# Altium project NyaBall.PrjPcb
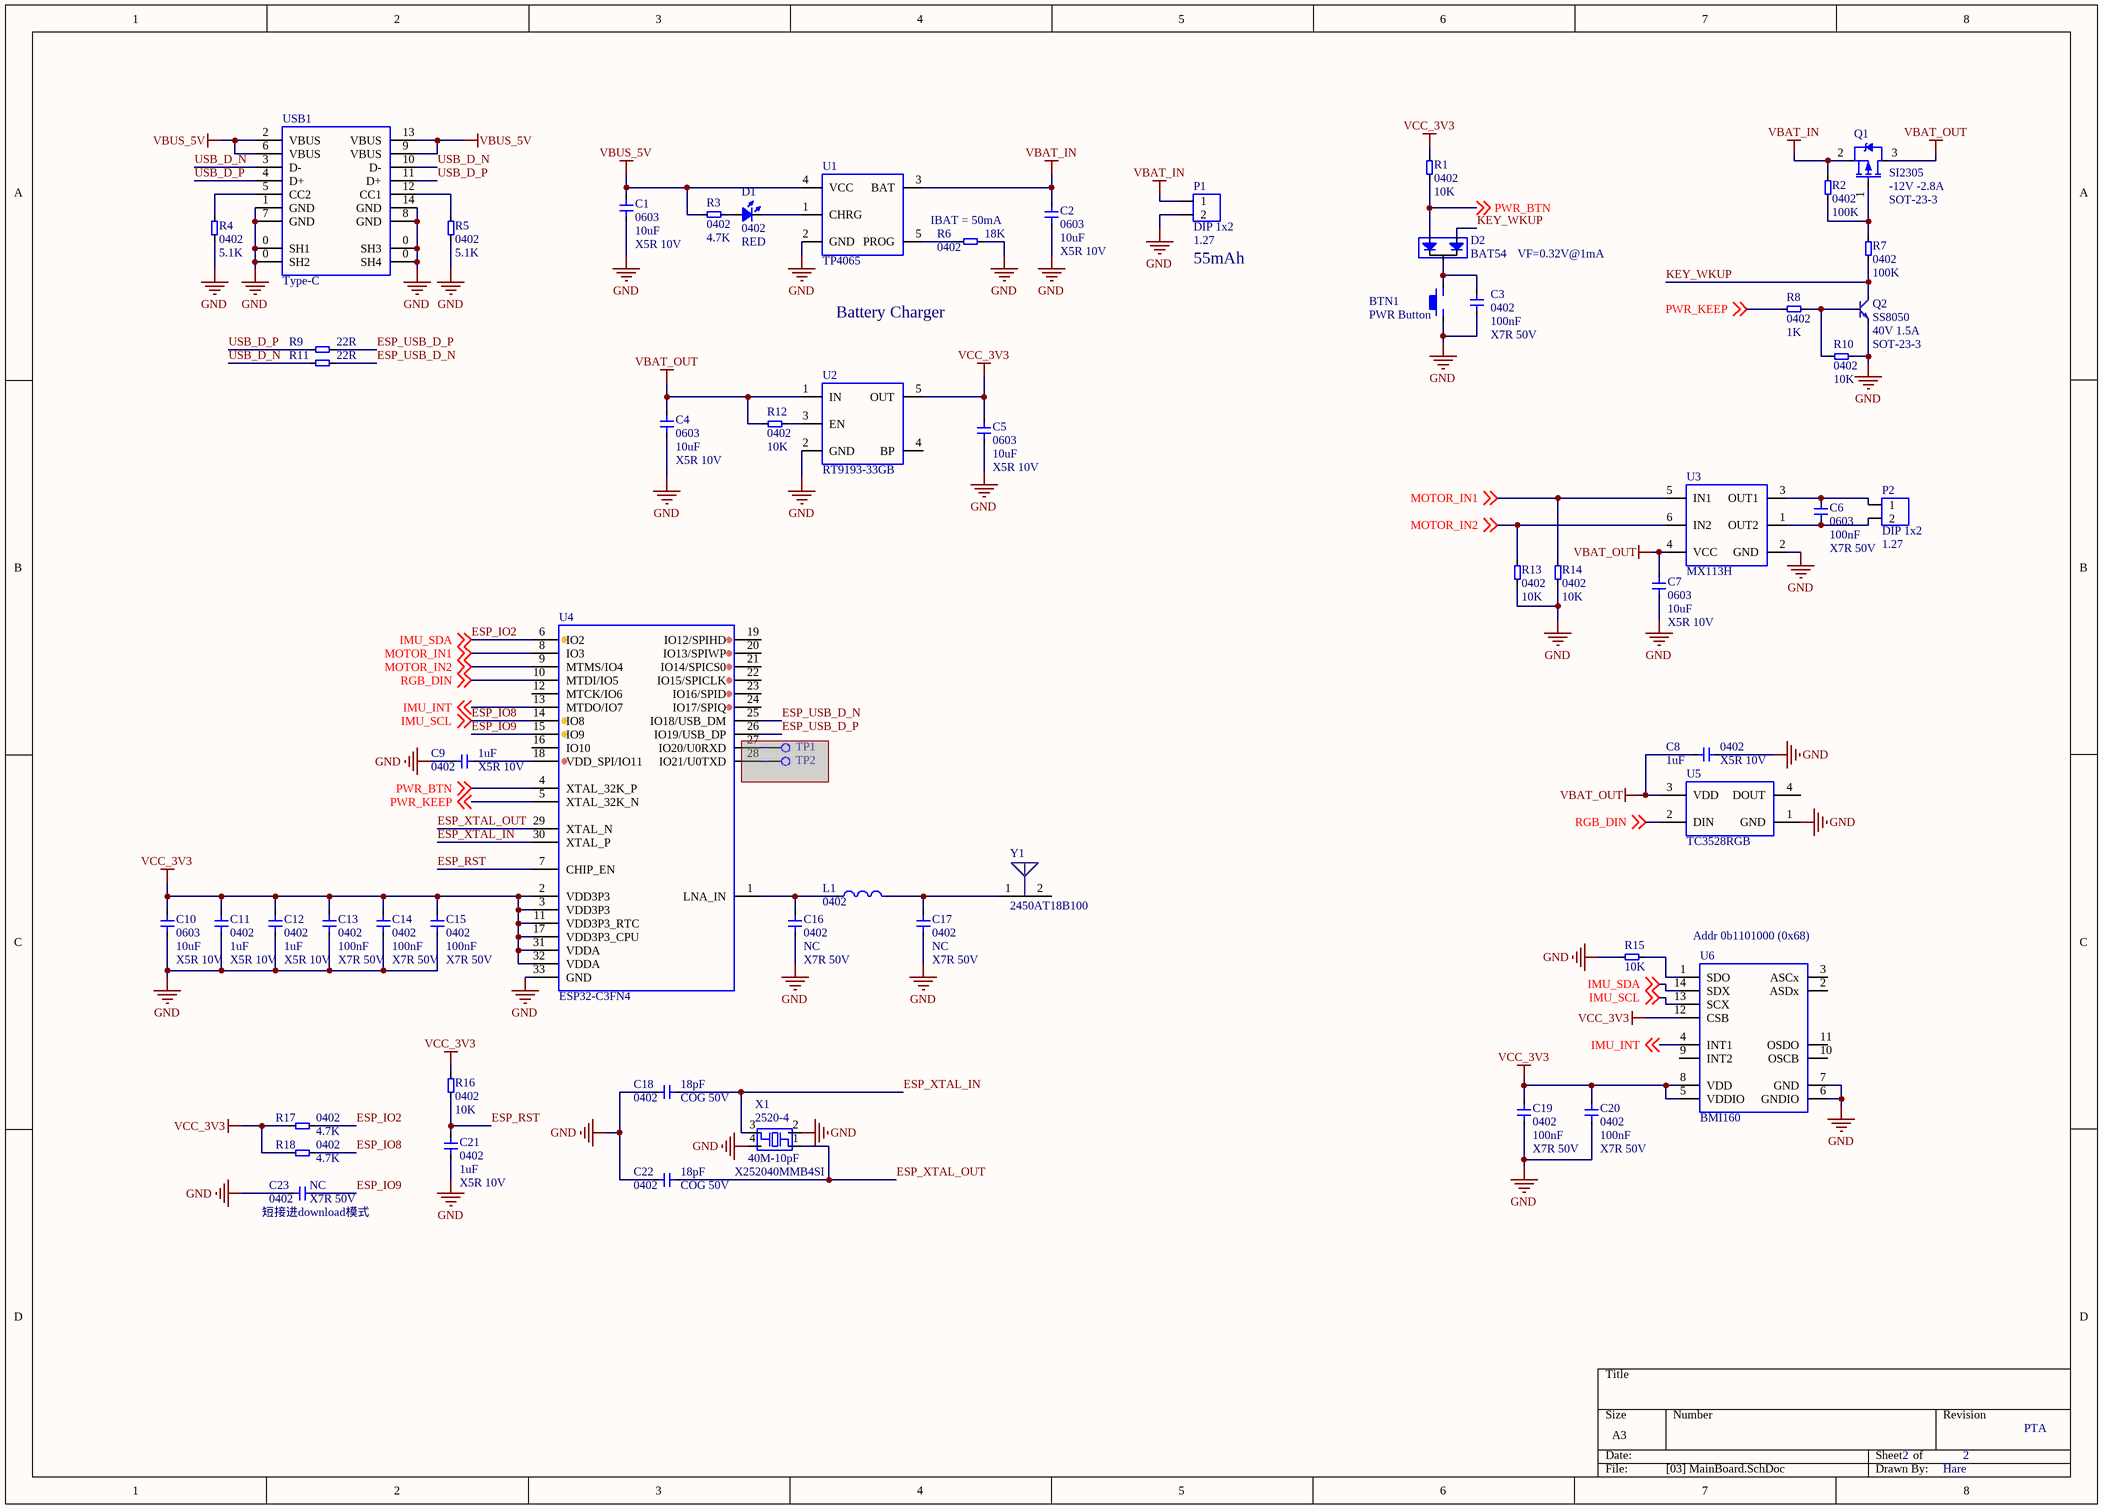
[diagram p0: [03] MainBoard.SchDoc]
1 sheet, 60 parts. Net scope: global (net labels, ports and power ports of the same name join across sheets).
Board file: NyaBall.PcbDoc

## Sheet [03] MainBoard.SchDoc
size A3

### Parts
BTN1  PWR Button  [BTN_2S]
C1  Footprint: 0603  Specification: X5R 10V  [CAP_0603]  (hidden comment: 10uF)
C2  Footprint: 0603  Specification: X5R 10V  [CAP_0603]  (hidden comment: 10uF)
C3  Footprint: 0402  Specification: X7R 50V  [CAP_0402]  (hidden comment: 100nF)
C4  Footprint: 0603  Specification: X5R 10V  [CAP_0603]  (hidden comment: 10uF)
C5  Footprint: 0603  Specification: X5R 10V  [CAP_0603]  (hidden comment: 10uF)
C6  Footprint: 0603  Specification: X7R 50V  [CAP_0402]  (hidden comment: 100nF)
C7  Footprint: 0603  Specification: X5R 10V  [CAP_0603]  (hidden comment: 10uF)
C8  Footprint: 0402  Specification: X5R 10V  [CAP_0402]  (hidden comment: 1uF)
C9  Footprint: 0402  Specification: X5R 10V  [CAP_0402]  (hidden comment: 1uF)
C10  Footprint: 0603  Specification: X5R 10V  [CAP_0603]  (hidden comment: 10uF)
C11  Footprint: 0402  Specification: X5R 10V  [CAP_0402]  (hidden comment: 1uF)
C12  Footprint: 0402  Specification: X5R 10V  [CAP_0402]  (hidden comment: 1uF)
C13  Footprint: 0402  Specification: X7R 50V  [CAP_0402]  (hidden comment: 100nF)
C14  Footprint: 0402  Specification: X7R 50V  [CAP_0402]  (hidden comment: 100nF)
C15  Footprint: 0402  Specification: X7R 50V  [CAP_0402]  (hidden comment: 100nF)
C16  Footprint: 0402  Specification: X7R 50V  [CAP_0402]  (hidden comment: NC)
C17  Footprint: 0402  Specification: X7R 50V  [CAP_0402]  (hidden comment: NC)
C18  Footprint: 0402  Specification: COG 50V  [CAP_0402]  (hidden comment: 18pF)
C19  Footprint: 0402  Specification: X7R 50V  [CAP_0402]  (hidden comment: 100nF)
C20  Footprint: 0402  Specification: X7R 50V  [CAP_0402]  (hidden comment: 100nF)
C21  Footprint: 0402  Specification: X5R 10V  [CAP_0402]  (hidden comment: 1uF)
C22  Footprint: 0402  Specification: COG 50V  [CAP_0402]  (hidden comment: 18pF)
C23  Footprint: 0402  Specification: X7R 50V  [CAP_0402]  (hidden comment: NC)
D1  Footprint: 0402  [LED_0402]  (hidden comment: RED)
D2  BAT54  [SOT-23-3]
L1  Footprint: 0402  [IND_0402]  (hidden comment: 0R)
P1  Type: 1.27  [HDR1X2_1.27_180]  (hidden comment: DIP 1x2)
P2  Type: 1.27  [HDR1X2_1.27_180]  (hidden comment: DIP 1x2)
Q1  Specification: -12V -2.8A  [SOT-23-3]  (hidden comment: SI2305)
Q2  Specification: 40V 1.5A  [SOT-23-3]  (hidden comment: SS8050)
R1  Footprint: 0402  [RES_0402]  (hidden comment: 10K)
R2  Footprint: 0402  [RES_0402]  (hidden comment: 100K)
R3  Footprint: 0402  [RES_0402]  (hidden comment: 4.7K)
R4  Footprint: 0402  [RES_0402]  (hidden comment: 5.1K)
R5  Footprint: 0402  [RES_0402]  (hidden comment: 5.1K)
R6  Footprint: 0402  [RES_0402]  (hidden comment: 18K)
R7  Footprint: 0402  [RES_0402]  (hidden comment: 100K)
R8  Footprint: 0402  [RES_0402]  (hidden comment: 1K)
R9  22R  [RES_0402]
R10  Footprint: 0402  [RES_0402]  (hidden comment: 10K)
R11  22R  [RES_0402]
R12  Footprint: 0402  [RES_0402]  (hidden comment: 10K)
R13  Footprint: 0402  [RES_0402]  (hidden comment: 10K)
R14  Footprint: 0402  [RES_0402]  (hidden comment: 10K)
R15  10K  [RES_0402]
R16  Footprint: 0402  [RES_0402]  (hidden comment: 10K)
R17  Footprint: 0402  [RES_0402]  (hidden comment: 4.7K)
R18  Footprint: 0402  [RES_0402]  (hidden comment: 4.7K)
TP1  TestPoint  [TESTPOINT]  (value not drawn)  (masked out: inside a compile mask, not in the netlist)
TP2  TestPoint  [TESTPOINT]  (value not drawn)  (masked out: inside a compile mask, not in the netlist)
U1  TP4065  [SOT-23-5]
U2  RT9193-33GB  [SOT-23-5]
U3  MX113H  [SOT-23-6]
U4  ESP32-C3FN4  [QFN-32-5x5-P0.5]
U5  TC3528RGB  [LED_3528_RGB]
U6  BMI160  [LGA-14-2.5X3.0-P0.5]
USB1  Type-C  [USB-C-TH_TYPE-C-USB-14P]
X1  Specification: 40M-10pF  Footprint: 2520-4  [XTAL_2520-4]  (hidden comment: X252040MMB4SI)
Y1  2450AT18B100  [ANT_2.4G_3.2x1.6]

### Nets
GND: BTN1.1 C1.1 C2.1 C3.2 C4.1 C5.1 C7.1 C8.1 C9.1 C10.1 C11.1 C12.1 C13.1 C14.1 C15.1 C16.1 C17.1 C18.1 C19.1 C20.1 C21.1 C22.1 C23.2 P1.2 Q2.2(E) R4.1 R5.1 R6.2 R10.1 R13.2 R14.2 R15.2 U1.2(GND) U2.2(GND) U3.2(GND) U4.33(GND) U5.1(GND) U6.6(GNDIO) U6.7(GND) USB1.0(SH4) USB1.1(GND) USB1.7(GND) USB1.8(GND) USB1.14(GND) X1.2(GND) X1.4(GND)
VBAT_IN: C2.2 P1.1 Q1.2(S) R2.2 U1.3(BAT)
VBAT_OUT: C4.2 C7.2 C8.2 Q1.3(D) R12.1 U2.1(IN) U3.4(VCC) U5.3(VDD)
VBUS_5V: C1.2 R3.2 U1.4(VCC) USB1.2(VBUS) USB1.6(VBUS) USB1.9(VBUS) USB1.13(VBUS)
VCC_3V3: C5.2 C10.2 C11.2 C12.2 C13.2 C14.2 C15.2 C19.2 C20.2 R1.2 R16.1 R17.2 R18.2 U2.5(OUT) U4.2(VDD3P3) U4.3(VDD3P3) U4.11(VDD3P3_RTC) U4.17(VDD3P3_CPU) U4.31(VDDA) U4.32(VDDA) U6.5(VDDIO) U6.8(VDD) U6.12(CSB)
ESP_IO2: R17.1 U4.6(IO2) U6.14(SDX) ; off-sheet IMU_SDA  [also labelled IMU_SDA]
ESP_IO8: R18.1 U4.14(IO8) U6.13(SCX) ; off-sheet IMU_SCL  [also labelled IMU_SCL]
ESP_IO9: C23.1 U4.15(IO9)
ESP_RST: C21.2 R16.2 U4.7(CHIP_EN)
ESP_USB_D_N: R11.2 U4.25(IO18/USB_DM)
ESP_USB_D_P: R9.2 U4.26(IO19/USB_DP)
ESP_XTAL_IN: C18.2 U4.30(XTAL_P) X1.3(OUT)
ESP_XTAL_OUT: C22.2 U4.29(XTAL_N) X1.1(IN)
IMU_INT: U4.13(MTDO/IO7) U6.4(INT1) ; off-sheet IMU_INT
KEY_WKUP: D2.2 Q2.3(C) R7.1
MOTOR_IN1: R14.1 U3.5(IN1) U4.8(IO3) ; off-sheet MOTOR_IN1
MOTOR_IN2: R13.1 U3.6(IN2) U4.9(MTMS/IO4) ; off-sheet MOTOR_IN2
PWR_BTN: D2.1 R1.1 U4.4(XTAL_32K_P) ; off-sheet PWR_BTN
PWR_KEEP: R8.1 U4.5(XTAL_32K_N) ; off-sheet PWR_KEEP
RGB_DIN: U4.10(MTDI/IO5) U5.2(DIN) ; off-sheet RGB_DIN
USB_D_N: R11.1 USB1.3(D-) USB1.10(D-)
USB_D_P: R9.1 USB1.4(D+) USB1.11(D+)
NetBTN1_2: BTN1.2 C3.1 D2.3
NetC6_1: C6.1 P2.2 U3.1(OUT2)
NetC6_2: C6.2 P2.1 U3.3(OUT1)
NetC9_2: C9.2 U4.18(VDD_SPI/IO11)
NetC16_2: C16.2 L1.1 U4.1(LNA_IN)
NetC17_2: C17.2 L1.2 Y1.1(FP)
NetD1_1: D1.1(A) R3.1
NetD1_2: D1.2(K) U1.1(CHRG)
NetQ1_1: Q1.1(G) R2.1 R7.2
NetQ2_1: Q2.1(B) R8.2 R10.2
NetR4_2: R4.2 USB1.5(CC2)
NetR5_2: R5.2 USB1.12(CC1)
NetR6_1: R6.1 U1.5(PROG)
NetR12_2: R12.2 U2.3(EN)
NetR15_1: R15.1 U6.1(SDO)

Not connected (* = marked no-connect by the designer): U2 4(BP); U4 12(MTCK/IO6) 16(IO10) 19(IO12/SPIHD) 20(IO13/SPIWP) 21(IO14/SPICS0) 22(IO15/SPICLK) 23(IO16/SPID) 24(IO17/SPIQ) 27(IO20/U0RXD) 28(IO21/U0TXD); U5 4(DOUT); U6 2(ASDx) 3(ASCx) 9(INT2) 10(OSCB) 11(OSDO); Y1 2(NC)

### Notes on the sheet
- (near R6) IBAT = 50mA
- Battery Charger
- (near P1) 55mAh
- VF=0.32V@1mA
- (near U6) Addr 0b1101000 (0x68)
- (near C23) 短接进download模式
- 2
- PTA
- Hare
- Title
- Size:
- Date:
- A4
- Number:
- Time:
- Revision:
- Sheet
- of
- File:

### Library data of the parts
BTN1 = Button
C1-C23 = CAP: Capacitor; Manufacturer: *
  C1 C2 C4 C5 C7 C10: Value: 10uF
  C3 C6 C13-C15 C19 C20: Value: 100nF
  C8 C9 C11 C12 C21: Value: 1uF
  C16 C17 C23: Value: NC
  C18 C22: Value: 18pF
D1 = LED: Value: RED
D2 = Diode-2: Value: BAT54
L1 = IND: Inductor; Specification: 2.2A; Manufacturer: *; Value: 0R
P1 P2 = HDR1x2: Header; Value: DIP 1x2
Q1 = MOS-P: P-Channel MOSFET; Value: SI2305
Q2 = BJT_NPN: Transistor; Value: SS8050
R1-R18 = RES: Resistor; Specification: ±1%; Manufacturer: *
  R1 R10 R12-R14 R16: Value: 10K
  R2 R7: Value: 100K
  R3 R17 R18: Value: 4.7K
  R4 R5: Value: 5.1K
  R6: Value: 18K
  R8: Value: 1K
  R9 R11: Footprint: 0402; Value: 22R
  R15: Footprint: 0402; Value: 10K
U1 = TP4065: TP4065线性锂离子电池充电器
U2 = RT9193: LDO
U3 = MX113H: 电机驱动 VCC=6.5V 条件下最大持续输出电流达到 1A，最大峰值输出电流达到 1.5A；工作电压2V 到 8V
U4 = ESP32-C3
U6 = BMI160: low power IMU
USB1 = USB-Type-C-14P
X1 = XTAL-4P: Value: X252040MMB4SI
Y1 = ANTENNA